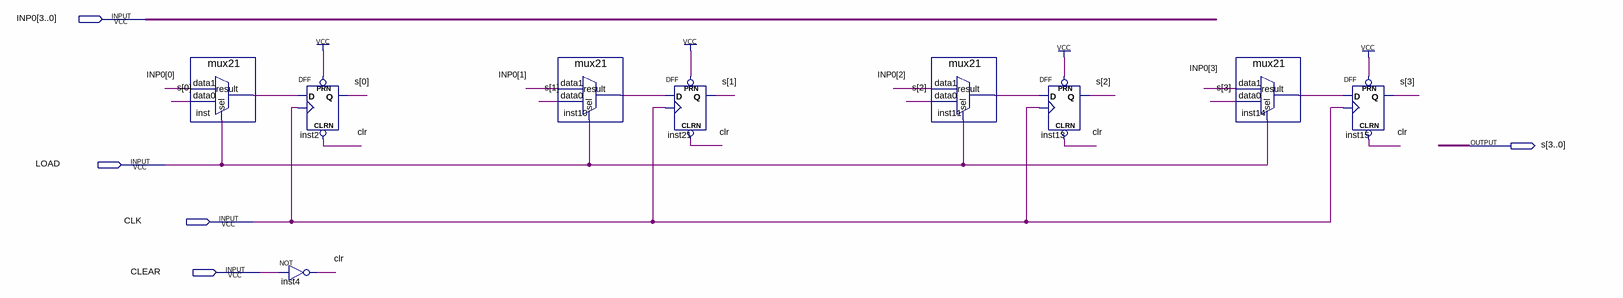
[diagram p0: schematic sheet]
// Quartus schematic resg.bdf as structural Verilog: 9 symbols, 5 pins
module resg (
  input  [3:0] INP0,
  input  LOAD,
  input  CLK,
  input  CLEAR,
  output [3:0] s
);

  wire clr, inst10_result, inst11_result, inst14_result, inst_result;

  mux21 inst (.data1(INP0[0]), .data0(s[0]), .sel(LOAD), .result(inst_result));
  DFF inst2 (.CLRN(clr), .CLK(CLK), .D(inst_result), .PRN(1'b1), .Q(s[0]));
  not inst4 (clr, CLEAR);
  mux21 inst10 (.data1(INP0[1]), .data0(s[1]), .sel(LOAD), .result(inst10_result));
  DFF inst21 (.CLRN(clr), .CLK(CLK), .D(inst10_result), .PRN(1'b1), .Q(s[1]));
  mux21 inst11 (.data1(INP0[2]), .data0(s[2]), .sel(LOAD), .result(inst11_result));
  DFF inst13 (.CLRN(clr), .CLK(CLK), .D(inst11_result), .PRN(1'b1), .Q(s[2]));
  mux21 inst14 (.data1(INP0[3]), .data0(s[3]), .sel(LOAD), .result(inst14_result));
  DFF inst15 (.CLRN(clr), .CLK(CLK), .D(inst14_result), .PRN(1'b1), .Q(s[3]));
endmodule
